# EAGLE schematic tinyPipes-proto (EAGLE 6.5.0)

## Sheet 1 of 3
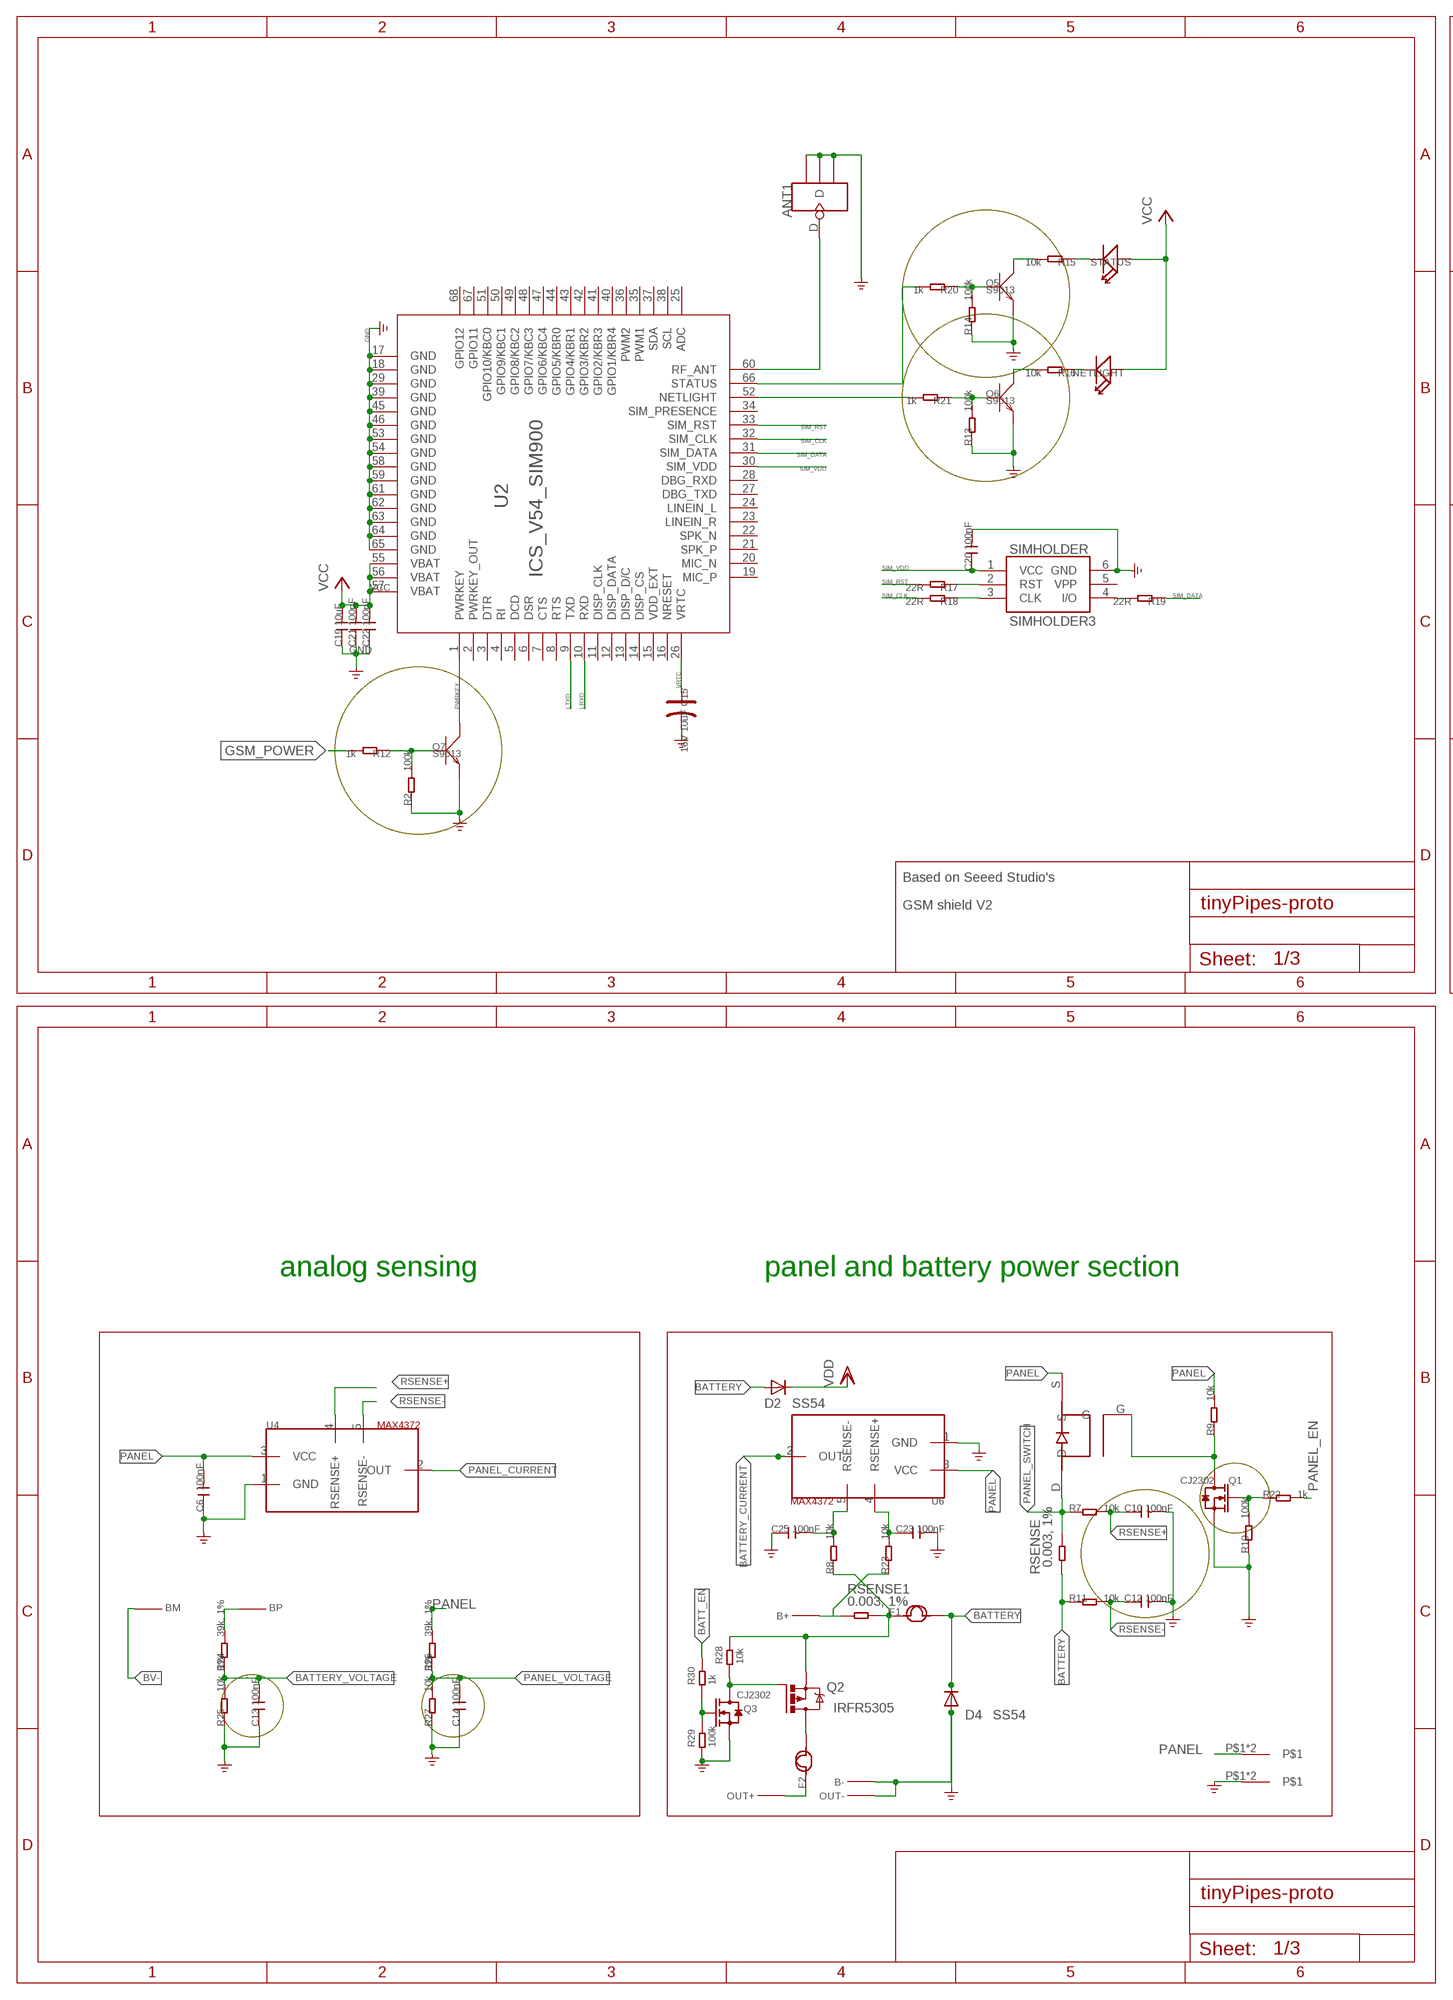
[diagram p0: schematic, sheet 1, part 1 of 2]
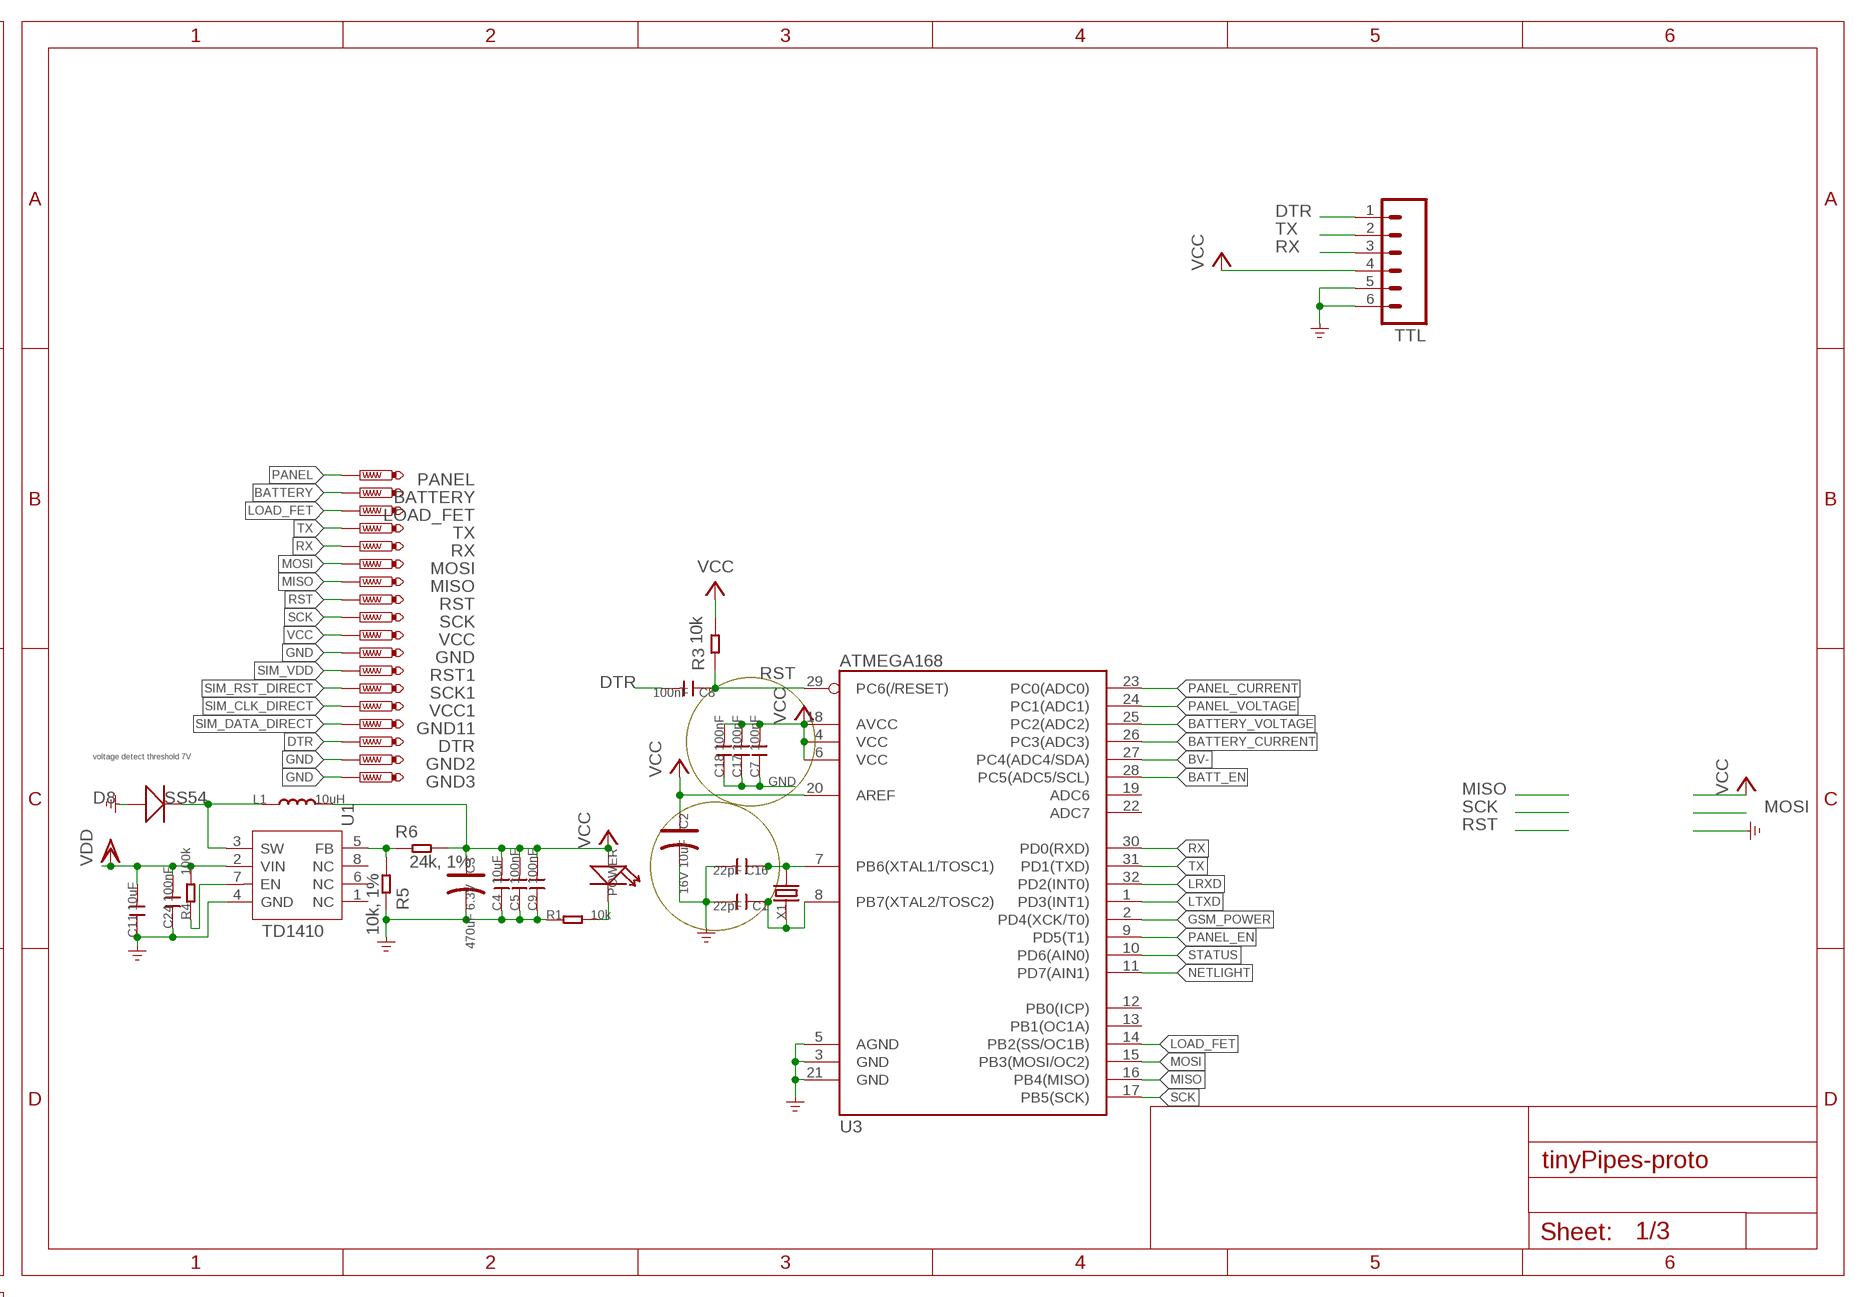
[diagram p1: schematic, sheet 1, part 2 of 2]

### Parts
ANT1  ANTENNA-U-FL  [4P-U-FL]
B+  TINYPIPES_BATTBATT  [TINYPIPES_BATT]
B-  TINYPIPES_BATTBATT  [TINYPIPES_BATT]
BATTERY  PTR1B2,54  [B2,54]
BM  TINYPIPES_BATTSBATT  [TINYPIPES_SBATT]
BP  TINYPIPES_BATTSBATT  [TINYPIPES_SBATT]
C1  22pF  C-0603  [C0603]
C2  16V 10uF  CAP-AVX-A  [AVX-A]
C3  470uF 6.3V  CAP-AVX-D  [AVX-D]
C4  10uF  C-0805  [C0805]
C5  100nF  C-0603  [C0603]
C6  100nF  C-0603  [C0603]
C7  100nF  C-0603  [C0603]
C8  100nF  C-0603  [C0603]
C9  100nF  C-0603  [C0603]
C10  100nF  C-0805  [C0805]
C11  10uF  C-0805  [C0805]
C12  100nF  C-0805  [C0805]
C13  100nF  C-0603  [C0603]
C14  100nF  C-0603  [C0603]
C15  16V 10uF  CAP-AVX-A  [AVX-A]
C16  22pF  C-0603  [C0603]
C17  100nF  C-0603  [C0603]
C18  100nF  C-0603  [C0603]
C19  10uF  C-0805  [C0805]
C20  100nF  C-0603  [C0603]
C21  100nF  C-0603  [C0603]
C22  100nF  C-0603  [C0603]
C23  100nF  C-0805  [C0805]
C24  100nF  C-0603  [C0603]
C25  100nF  C-0805  [C0805]
D2  SS54  DIODE-SMB  [SMB]
D4  SS54  DIODE-SMB  [SMB]
D8  SS54  D'MBRS240LT3'  [SMB]
DTR  PTR1B2,54  [B2,54]
F1  FUSE16R700  [0210]
F2  FUSE16R700  [0210]
GND  PTR1B2,54  [B2,54]
GND2  PTR1B2,54  [B2,54]
GND3  PTR1B2,54  [B2,54]
GND11  PTR1B2,54  [B2,54]
L1  10uH  L'0630'  [L0630]
LOAD_FET  PTR1B2,54  [B2,54]
MISO  PTR1B2,54  [B2,54]
MOSI  PTR1B2,54  [B2,54]
NETLIGHT  LED'0603'  [LED-0603]
OUT+  TINYPIPES_BATTBATT  [TINYPIPES_BATT]
OUT-  TINYPIPES_BATTBATT  [TINYPIPES_BATT]
PANEL  PTR1B2,54  [B2,54]
PANEL+  TINYPIPES_BATTPANEL  [TINYPIPES_PANEL]
PANEL-  TINYPIPES_BATTPANEL  [TINYPIPES_PANEL]
POWER  LED'0603'  [LED-0603]
Q1  CJ2302  MOSFET-N'SOT23'  [SOT23]
Q2  IRFR5305  [D-PAK_TO252AA]
Q3  CJ2302  MOSFET-N'SOT23'  [SOT23]
Q5  S9013  TRANSISTOR-NPN-SOT23  [SOT23]
Q6  S9013  TRANSISTOR-NPN-SOT23  [SOT23]
Q7  S9013  TRANSISTOR-NPN-SOT23  [SOT23]
R1  10k  R-0603  [R0603]
R2  100k  R-0603  [R0603]
R3  10k  R-0603  [R0603]
R4  100k  R-0603  [R0603]
R5  10k, 1%  R-0603  [R0603]
R6  24k, 1%  R-0603  [R0603]
R7  10k  R-0603  [R0603]
R8  10k  R-0603  [R0603]
R9  10k  R-0603  [R0603]
R10  100k  R-0603  [R0603]
R11  10k  R-0603  [R0603]
R12  1k  R-0603  [R0603]
R13  100k  R-0603  [R0603]
R14  100k  R-0603  [R0603]
R15  10k  R-0603  [R0603]
R16  10k  R-0603  [R0603]
R17  22R  R-0603  [R0603]
R18  22R  R-0603  [R0603]
R19  22R  R-0603  [R0603]
R20  1k  R-0603  [R0603]
R21  1k  R-0603  [R0603]
R22  1k  R-0603  [R0603]
R23  10k  R-0603  [R0603]
R24  39k, 1%  R-0603  [R0603]
R25  10k, 1%  R-0603  [R0603]
R26  39k, 1%  R-0603  [R0603]
R27  10k, 1%  R-0603  [R0603]
R28  10k  R-0603  [R0603]
R29  100k  R-0603  [R0603]
R30  1k  R-0603  [R0603]
RSENSE  0.003, 1%  R-2512  [R2512]
RSENSE1  0.003, 1%  R-2512  [R2512]
RST  PTR1B2,54  [B2,54]
RST1  PTR1B2,54  [B2,54]
RX  PTR1B2,54  [B2,54]
SCK  PTR1B2,54  [B2,54]
SCK1  PTR1B2,54  [B2,54]
SIMHOLDER  SIMHOLDER3  [SIMHOLDER3]
STATUS  LED'0603'  [LED-0603]
TTL  M06LOCK  [1X06_LOCK]
TX  PTR1B2,54  [B2,54]
U1  TD1410  [SOP8]
U2  ICS_V54_SIM900  [ICS_V54_SIM900]
U3  ATMEGA168  [TQFP32-08]
U4  MAX4372  [SOT23-5]
U5  SI4435POWER  [SO8_FET]
U6  MAX4372  [SOT23-5]
VCC  PTR1B2,54  [B2,54]
VCC1  PTR1B2,54  [B2,54]
X1  CRYSTAL'5032'  [2P-SMD-5X3.2]

### Nets
BATT [power]: B+.1 R23.1 RSENSE1.1
BATT_EN: R30.2 U3.28(PC5(ADC5/SCL))
BATTERY [power]: BATTERY.TP D2.A D4.C F1.2 R11.1 RSENSE.1
BATTERY_CURRENT: U3.26(PC3(ADC3)) U6.2(OUT)
BATTERY_VOLTAGE: C13.2 R24.1 R25.2 U3.25(PC2(ADC2))
BV+: BP.P$1 R24.2
BV-: BM.P$1 U3.27(PC4(ADC4/SDA))
DTR: C8.2 DTR.TP TTL.1
GND: ANT1.GND1 ANT1.GND2 ANT1.GND3 B-.1 C1.2 C2.- C3.- C4.1 C5.1 C6.1 C7.1 C9.1 C10.2 C11.1 C12.2 C13.1 C14.1 C15.- C16.2 C17.1 C18.1 C19.1 C20.2 C21.1 C22.1 C23.2 C24.1 C25.1 D4.A D8.+ GND2.TP GND3.TP GND.TP OUT-.1 PANEL-.P$1 PANEL-.P$2 Q1.2(S) Q3.2(S) Q5.2(E) Q6.2(E) Q7.2(E) R1.1 R2.1 R5.2 R10.1 R13.1 R14.1 R25.1 R27.1 R29.1 SIMHOLDER.6(GND) TTL.5 TTL.6 U1.4(GND) U2.17(GND) U2.18(GND) U2.29(GND) U2.39(GND) U2.45(GND) U2.46(GND) U2.53(GND) U2.54(GND) U2.58(GND) U2.59(GND) U2.61(GND) U2.62(GND) U2.63(GND) U2.64(GND) U2.65(GND) U3.3(GND) U3.5(AGND) U3.21(GND) U4.1(GND) U6.1(GND)
GSM_POWER: R12.2 U3.2(PD4(XCK/T0))
LOAD_FET: LOAD_FET.TP U3.14(PB2(SS/OC1B))
LRXD: U2.10(RXD) U3.32(PD2(INT0))
LTXD: U2.9(TXD) U3.1(PD3(INT1))
MISO: MISO.TP U3.16(PB4(MISO))
MOSI: MOSI.TP U3.15(PB3(MOSI/OC2))
N$1: ANT1.D U2.60(RF_ANT)
N$2: C16.1 U3.7(PB6(XTAL1/TOSC1)) X1.2
N$3: Q6.3(C) R16.2
N$4: Q7.1(B) R2.2 R12.1
N$5: Q5.1(B) R14.2 R20.1
N$6: Q6.1(B) R13.2 R21.1
N$7: NETLIGHT.- R16.1
N$8: Q5.3(C) R15.2
N$9: POWER.- R1.2
N$10 [power]: F1.1 Q2.3(S) R8.1 R28.2 RSENSE1.2
N$11: Q1.1(G) R10.2 R22.1
N$12: R4.1 U1.7(EN)
N$13: C1.1 U3.8(PB7(XTAL2/TOSC2)) X1.1
N$14: C25.2 R8.2 U6.5(RSENSE-)
N$15: Q1.3(D) R9.1 U5.G
N$16: R15.1 STATUS.-
N$17: C23.1 R23.2 U6.4(RSENSE+)
N$18: F2.2 Q2.4(D)
N$19: F2.1 OUT+.1
N$20: Q2.1(G) Q3.3(D) R28.1
N$21: Q3.1(G) R29.2 R30.1
N$38: D8.- L1.1 U1.3(SW)
N$47: R5.1 R6.1 U1.5(FB)
NETLIGHT: R21.2 U2.52(NETLIGHT) U3.11(PD7(AIN1))
PANEL [power]: C6.2 PANEL+.P$1 PANEL+.P$2 PANEL.TP R9.2 R26.2 U4.3(VCC) U5.S U6.3(VCC)
PANEL_CURRENT: U3.23(PC0(ADC0)) U4.2(OUT)
PANEL_EN: R22.2 U3.9(PD5(T1))
PANEL_SWITCH [power]: R7.1 RSENSE.2 U5.D
PANEL_VOLTAGE: C14.2 R26.1 R27.2 U3.24(PC1(ADC1))
PWRKEY: Q7.3(C) U2.1(PWRKEY)
RSENSE+ [power]: C10.1 R7.2 U4.4(RSENSE+)
RSENSE- [power]: C12.1 R11.2 U4.5(RSENSE-)
RST: C8.1 R3.1 RST.TP U3.29(PC6(/RESET))
RX: RX.TP TTL.3 U3.30(PD0(RXD))
SCK: SCK.TP U3.17(PB5(SCK))
SIM_CLK: R18.2 U2.32(SIM_CLK)
SIM_CLK_DIRECT: R18.1 SIMHOLDER.3(CLK) VCC1.TP
SIM_DATA: R19.1 U2.31(SIM_DATA)
SIM_DATA_DIRECT: GND11.TP R19.2 SIMHOLDER.4(I/O)
SIM_RST: R17.2 U2.33(SIM_RST)
SIM_RST_DIRECT: R17.1 SCK1.TP SIMHOLDER.2(RST)
SIM_VDD: C20.1 RST1.TP SIMHOLDER.1(VCC) U2.30(SIM_VDD)
STATUS: R20.2 U2.66(STATUS) U3.10(PD6(AIN0))
TX: TTL.2 TX.TP U3.31(PD1(TXD))
VCC: C2.+ C3.+ C4.2 C5.2 C7.2 C9.2 C17.2 C18.2 C19.2 C21.2 C22.2 L1.2 NETLIGHT.+ POWER.+ R3.2 R6.2 STATUS.+ TTL.4 U2.55(VBAT) U2.56(VBAT) U2.57(VBAT) U3.4(VCC) U3.6(VCC) U3.18(AVCC) U3.20(AREF) VCC.TP
VDD: C11.2 C24.2 D2.C R4.2 U1.2(VIN)
VRTC: C15.+ U2.26(VRTC)
Unconnected: SIMHOLDER.5(VPP) U1.1(NC) U1.6(NC) U1.8(NC) U2.2(PWRKEY_OUT) U2.3(DTR) U2.4(RI) U2.5(DCD) U2.6(DSR) U2.7(CTS) U2.8(RTS) U2.11(DISP_CLK) U2.12(DISP_DATA) U2.13(DISP_D/C) U2.14(DISP_CS) U2.15(VDD_EXT) U2.16(NRESET) U2.19(MIC_P) U2.20(MIC_N) U2.21(SPK_P) U2.22(SPK_N) U2.23(LINEIN_R) U2.24(LINEIN_L) U2.25(ADC) U2.27(DBG_TXD) U2.28(DBG_RXD) U2.34(SIM_PRESENCE) U2.35(PWM1) U2.36(PWM2) U2.37(SDA) U2.38(SCL) U2.40(GPIO1/KBR4) U2.41(GPIO2/KBR3) U2.42(GPIO3/KBR2) U2.43(GPIO4/KBR1) U2.44(GPIO5/KBR0) U2.47(GPIO6/KBC4) U2.48(GPIO7/KBC3) U2.49(GPIO8/KBC2) U2.50(GPIO9/KBC1) U2.51(GPIO10/KBC0) U2.67(GPIO11) U2.68(GPIO12) U3.12(PB0(ICP)) U3.13(PB1(OC1A)) U3.19(ADC6) U3.22(ADC7)

### Notes on the sheet
- voltage detect threshold 7V
- Based on Seeed Studio's
- GSM shield V2
- analog sensing | panel and battery power section

## Sheet 2 of 3

## Sheet 3 of 3

## Library data of the parts
ANT1 = Connector:ANTENNA-U-FL
B+ B- BM BP OUT+ OUT- = tinyPipes v2.6:TINYPIPES_BATT
BATTERY DTR GND GND2 GND3 GND11 LOAD_FET MISO MOSI PANEL RST RST1 RX SCK SCK1 TX VCC VCC1 = testpad:PTR1: TEST PIN
C1 C4-C14 C16-C25 = Discrete:C*: Ceramic Capacitors
C2 C3 C15 = Discrete:CAP*: Electrolytic Capacitors,Tantalum Capacitors and Super Capacitors
D2 D4 = diode:DIODE-: DIODE
D8 = Discrete:D*
F1 F2 = tinyPipes v2.6:FUSE
L1 = Discrete:L*
NETLIGHT POWER STATUS = Discrete:LED*
PANEL+ PANEL- = tinyPipes_v2.5:TINYPIPES_BATT
Q1 Q3 = Discrete:MOSFET-N: IRLL014: http://www.vishay.com/docs/91319/sihll014.pdf
Q2 = transistor-power:IRF?5305: HEXFET Power MOSFET Source: http://www.irf.com/product-info/datasheets/data/irfr5305pbf.pdf
Q5-Q7 = Discrete:TRANSISTOR-NPN*: NPN audion
R1-R30 RSENSE RSENSE1 = Discrete:R*
SIMHOLDER = SparkFun2:SIMHOLDER3
TTL = SparkFun-Connectors:M06: Header 6 Standard 6-pin 0.1" header. Use with straight break away headers (SKU : PRT-00116), right angle break away headers (PRT-00553), swiss pins (PRT-00743), machine pins (PRT-00117), and female headers (PRT-00115). Molex polarized connector foot print use with SKU : PRT-08094 with associated crimp pins and housings. NOTES ON THE VARIANTS LOCK and LOCK_LONGPADS... This footprint was designed to help hold the alignment of a through-hole component (i.e. 6-pin header) while soldering it into place. You may notice that each hole has been shifted either up or down by 0.005 of an inch from it's more standard position (which is a perfectly straight line). This slight alteration caused the pins (the squares in the middle) to touch the edges of the holes. Because they are alternating, it causes a "brace" to hold the component in place. 0.005 has proven to be the perfect amount of "off-center" position when using our standard breakaway headers. Although looks a little odd when you look at the bare footprint, once you have a header in there, the alteration is very hard to notice. Also,if you push a header all the way into place, it is covered up entirely on the bottom side. This idea of altering the position of holes to aid alignment will be further integrated into the Sparkfun Library for other footprints. It can help hold any component with 3 or more connection pins.
U1 = template:TD1410: 2A 380KHz 20V PWM Buck DC/DC Converter
U2 = tinyPipes v2.2:ICS_V54_SIM900
U3 = SparkFun:ATMEGA168
U4 U6 = tinyPipes:MAX4372
U5 = tinyPipes:SI4435
X1 = Discrete:CRYSTAL*: CRYSTAL